# EAGLE design Logger ver2.0.0 (EAGLE 9.6.2)
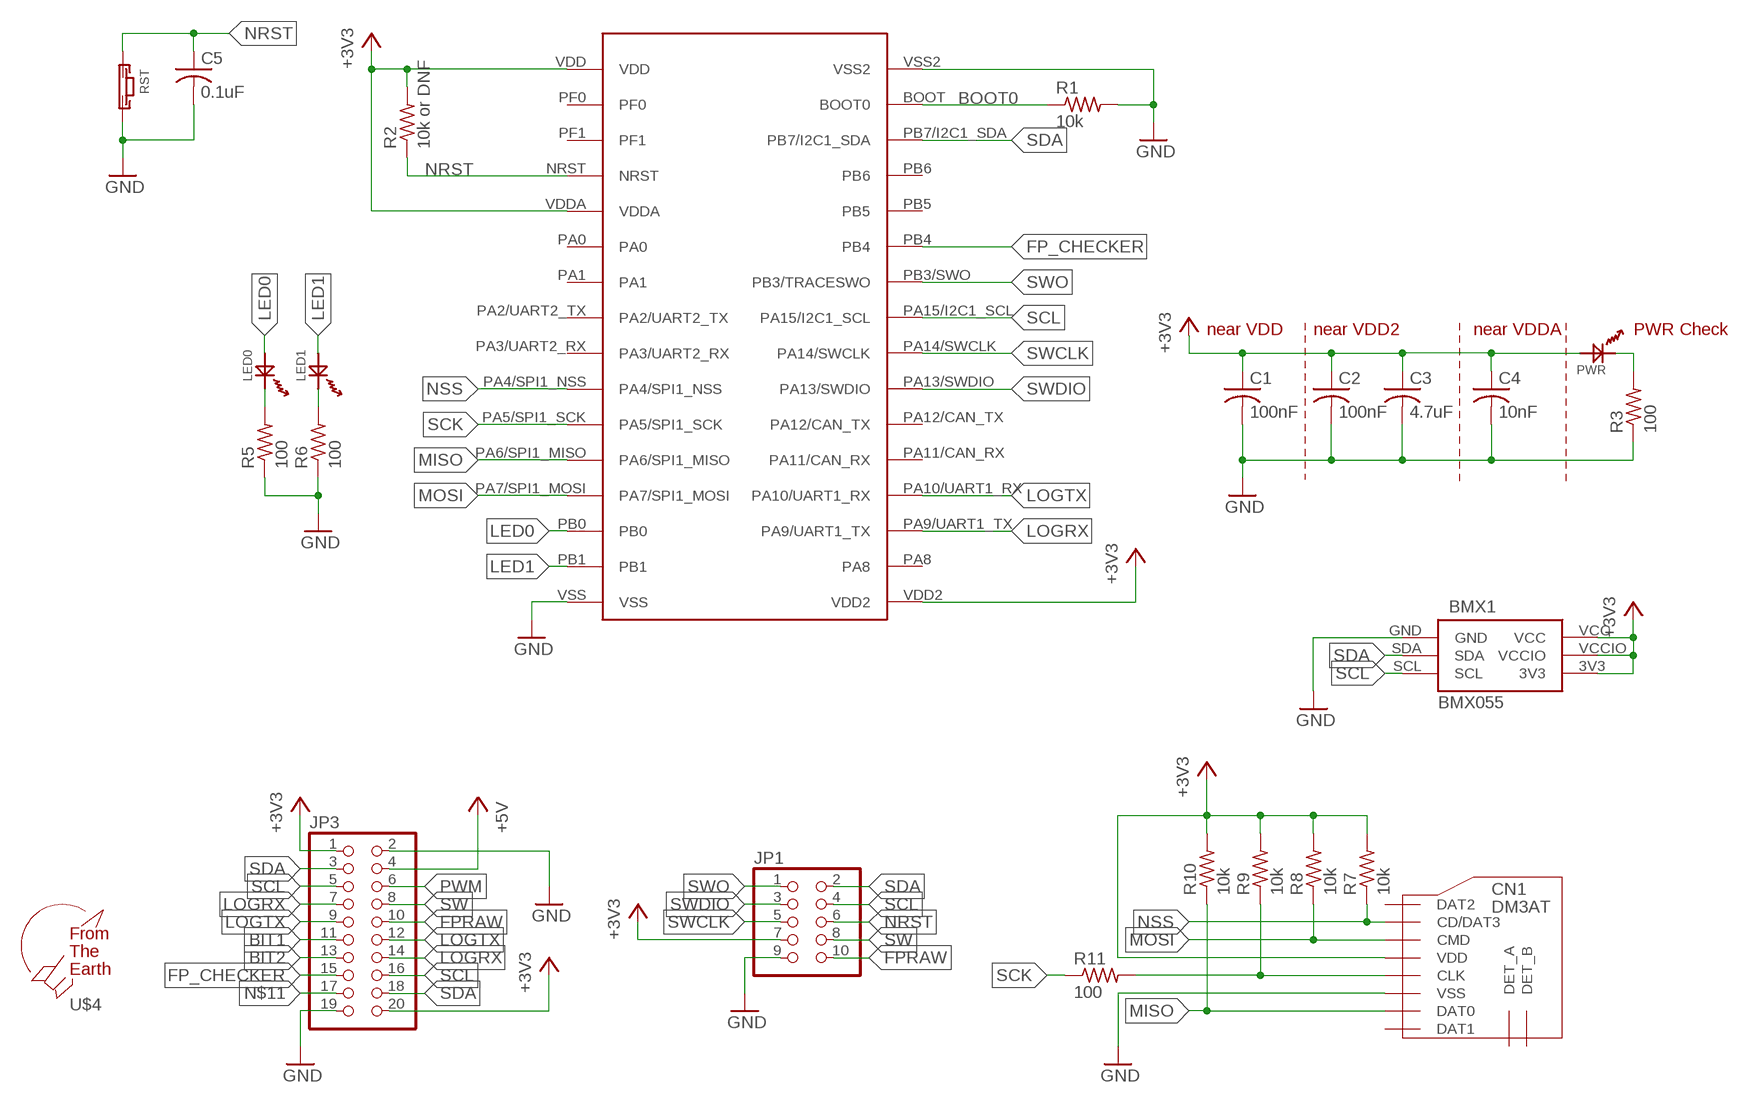
[diagram p0: schematic, sheet 1]

## Parts
BMX1  BMX055  [BMX055]
C1  100nF  C-USC1608  [C1608]
C2  100nF  C-USC1608  [C1608]
C3  4.7uF  C-USC1608  [C1608]
C4  10nF  C-USC1608  [C1608]
C5  0.1uF  C-USC1608  [C1608]
CN1  DM3AT  [DM3AT]
JP1  PINHD-2X5/90  [2X05/90]
JP3  PINHD-2X10/90  [2X10/90]
LED0  OSXX1608C1A  [OSXX1608C1A]
LED1  OSXX1608C1A  [OSXX1608C1A]
PWR  OSXX1608C1A  [OSXX1608C1A]
R1  10k  R-US_R0603  [R0603]
R2  10k or DNF  R-US_R0603  [R0603]
R3  100  R-US_R0603  [R0603]
R5  100  R-US_R0603  [R0603]
R6  100  R-US_R0603  [R0603]
R7  10k  R-US_R0603  [R0603]
R8  10k  R-US_R0603  [R0603]
R9  10k  R-US_R0603  [R0603]
R10  10k  R-US_R0603  [R0603]
R11  100  R-US_R0603  [R0603]
RST  TVAF06-A020B-R  [TVAF06-A020B-R]
U$1  STM32F303K8  [STM32F303K8]
U$4  F.T.E.LOGO  [LOGO]

## Nets
+3V3: BMX1.3V3 BMX1.VCC BMX1.VCCIO C1.1 C2.1 C3.1 C4.1 CN1.VDD JP1.7 JP3.1 JP3.20 PWR.AN R2.2 R7.2 R8.2 R9.2 R10.2 U$1.VDD U$1.VDD2 U$1.VDDA
BIT1: JP3.11
BIT2: JP3.13
BOOT0: R1.1 U$1.BOOT(BOOT0)
FP_CHECKER: JP3.15 U$1.PB4
FPRAW: JP1.10 JP3.10
GND: BMX1.GND C1.2 C2.2 C3.2 C4.2 C5.2 CN1.VSS JP1.9 JP3.2 JP3.19 R1.2 R3.1 R5.1 R6.1 RST.P$2 U$1.VSS U$1.VSS2
LED0: LED0.AN U$1.PB0
LED1: LED1.AN U$1.PB1
LOGRX: JP3.7 JP3.14 U$1.PA9/UART1_TX
LOGTX: JP3.9 JP3.12 U$1.PA10/UART1_RX
MISO: CN1.DAT0 R10.1 U$1.PA6/SPI1_MISO
MOSI: CN1.CMD R8.1 U$1.PA7/SPI1_MOSI
N$1: PWR.CT R3.2
N$2: LED0.CT R5.2
N$4: LED1.CT R6.2
N$7: CN1.CLK R9.1 R11.2
N$11: JP3.4 JP3.17 ; supply symbol labelled +5V
NRST: C5.1 JP1.6 R2.1 RST.P$1 U$1.NRST
NSS: CN1.CD/DAT3 R7.1 U$1.PA4/SPI1_NSS
PWM: JP3.6
SCK: R11.1 U$1.PA5/SPI1_SCK
SCL: BMX1.SCL JP1.4 JP3.5 JP3.16 U$1.PA15/I2C1_SCL
SDA: BMX1.SDA JP1.2 JP3.3 JP3.18 U$1.PB7/I2C1_SDA
SW: JP1.8 JP3.8
SWCLK: JP1.5 U$1.PA14/SWCLK
SWDIO: JP1.3 U$1.PA13/SWDIO
SWO: JP1.1 U$1.PB3/SWO(PB3/TRACESWO)
Unconnected: CN1.DAT1 CN1.DAT2 CN1.DET_A CN1.DET_B U$1.PA0 U$1.PA1 U$1.PA2/UART2_TX U$1.PA3/UART2_RX U$1.PA8 U$1.PA11/CAN_RX U$1.PA12/CAN_TX U$1.PB5 U$1.PB6 U$1.PF0 U$1.PF1

## Notes on the sheet
- near VDD | near VDD2 | near VDDA | PWR Check

## Library data of the parts
BMX1 = BMX055:BMX055
C1-C5 = rcl:C-US: CAPACITOR, American symbol; SPICEPREFIX: C
CN1 = microSD:DM3AT
JP1 = pinhead:PINHD-2X5: PIN HEADER
JP3 = pinhead:PINHD-2X10: PIN HEADER
LED0 LED1 PWR = Chip LED:OSXX1608C1A
R1-R3 R5-R11 = rcl:R-US_: RESISTOR, American symbol; SPICEPREFIX: R
RST = Tact switch:TVAF06-A020B-R
U$1 = STM32F303K8:STM32F303K8
U$4 = logo:F.T.E.LOGO

## Net classes
0 default: width 0.33 mm

## Board
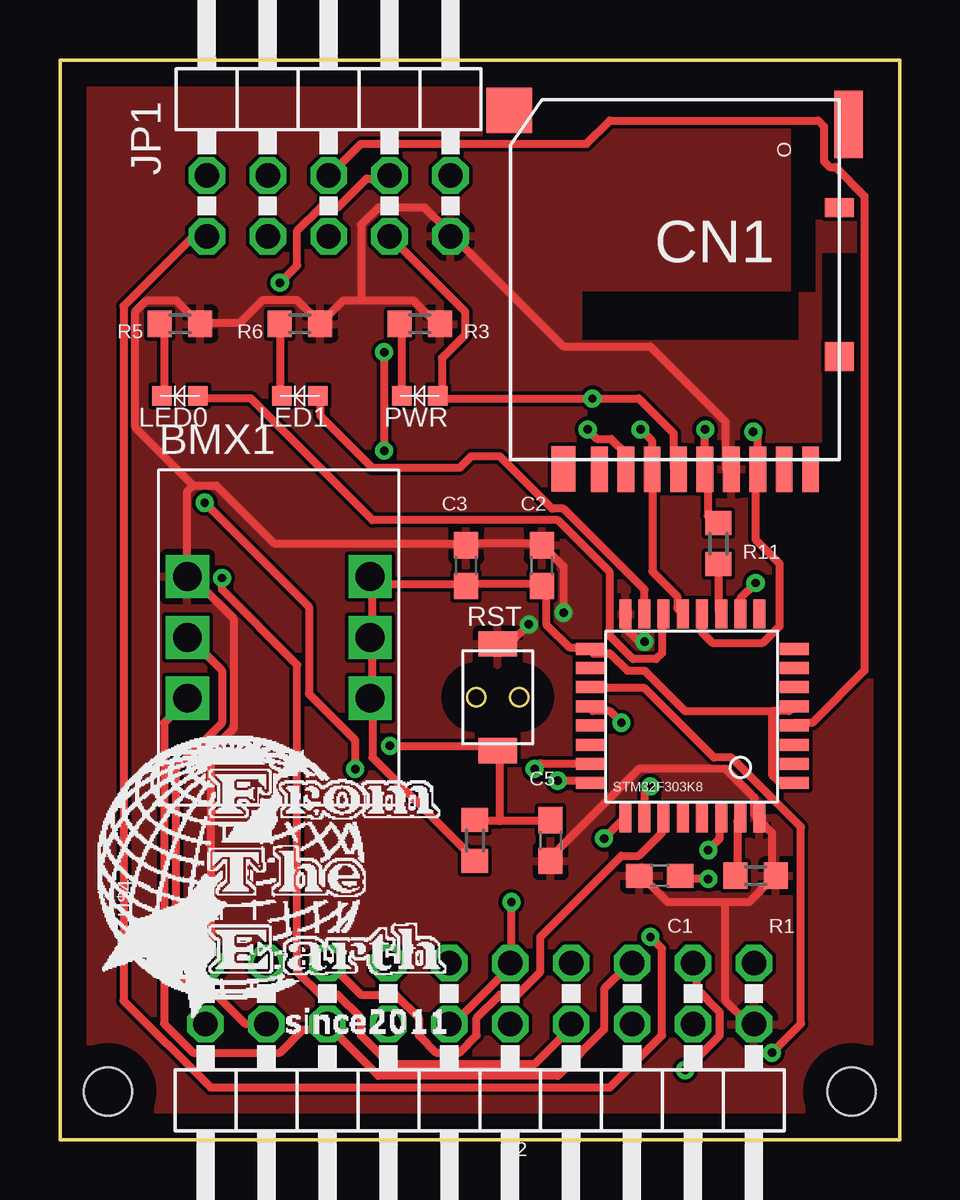
[diagram p1: board, top side]
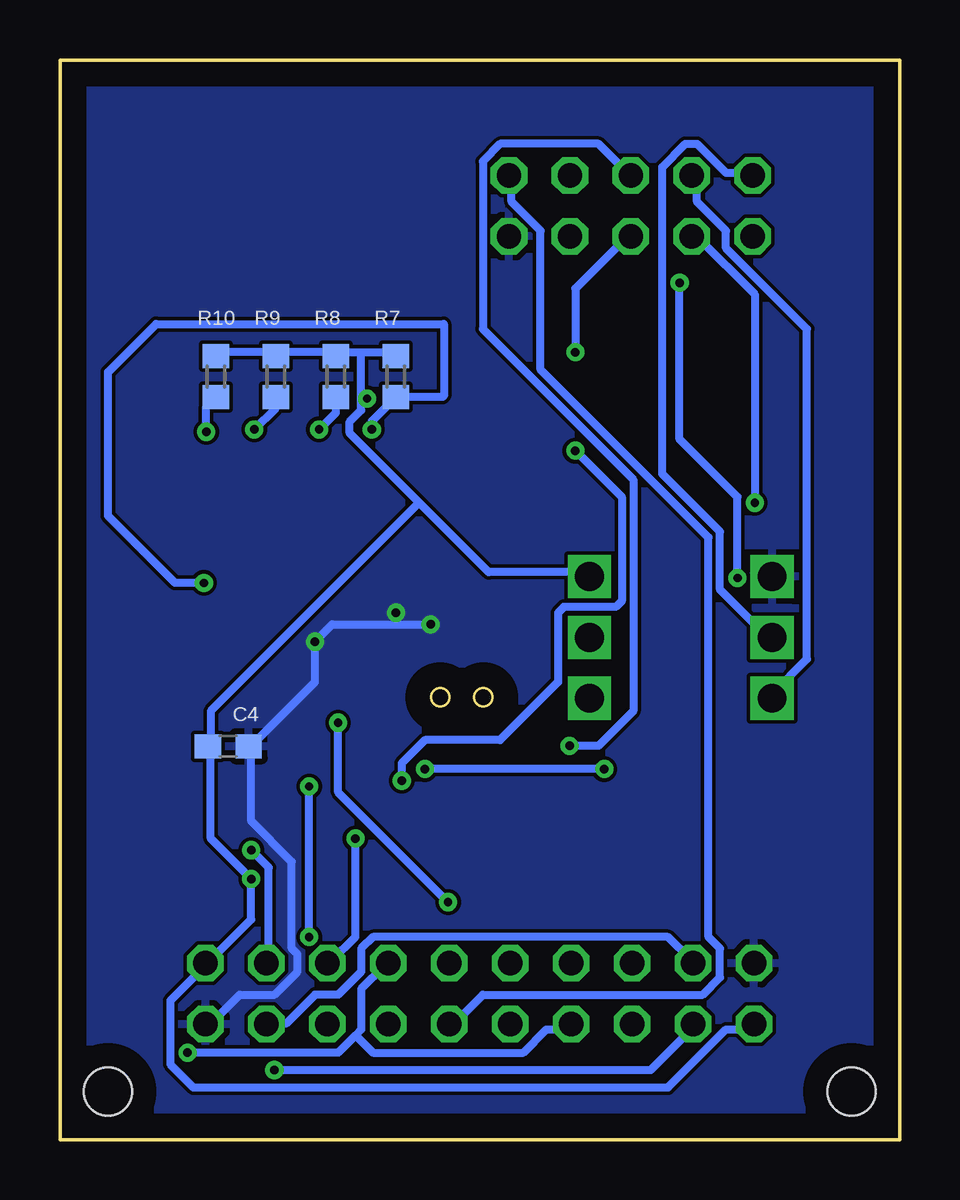
[diagram p2: board, bottom side, seen from below]

Size 35 x 45 mm. Coordinates in mm from the lower left corner, seen from the top.
Outline: 0,0 35,0 35,45 0,45 0,0
Copper layers (1*16): Top 0.035mm / dielectric 1.5mm / Bottom 0.035mm
Design rules "default": minimum track width 6mil, minimum drill 0.35mm, track to track 6mil, track to pad 6mil, pad to pad 6mil, via to via 6mil, smd to smd 6mil, copper to edge 40mil, drill to drill 6mil, minimum pad ring 10mil, minimum via ring 8mil, stop-mask expansion 4mil, vias tented up to drill 0mil, thermal gap 10mil
Holes 2 mm at 2,2 33,2

### Footprints (pad centres in the part's own frame; a part is rotated, then mirrored left to right if it is on the bottom)
BMX055 = drill 1.2 pad 1.5 square: 3V3 8.81,-9.53; GND 1.19,-4.46; SCL 1.19,-9.53; SDA 1.19,-7; VCC 8.81,-4.46; VCCIO 8.81,-7
C1608 = smd 1.1 x 1: 1 -0.85,0; 2 0.85,0
DM3AT = smd 0.7 x 1.9: CD/DAT3 2.2,6.4; CLK -1.1,6.4; CMD 1.1,6.4; DAT0 -3.3,6.4; DAT1 -4.4,6.4; DAT2 3.3,6.4; DET_B -5.5,6.4; VDD 0,6.4; VSS -2.2,6.4 | smd 1.2 x 0.8: DET_A -6.7,-4.5 | smd 1 x 1.9: P$9 4.8,6.381 | smd 1.2 x 1.2: P$11 -6.7,1.7 | smd 1.2 x 2.8: P$13 -7.081,-7.973 | smd 1.9 x 1.9: P$14 7.054,-8.562
2X05/90 = drill 1.016 octagon: 1 -5.08,-6.35; 2 -5.08,-3.81; 3 -2.54,-6.35; 4 -2.54,-3.81; 5 0,-6.35; 6 0,-3.81; 7 2.54,-6.35; 8 2.54,-3.81; 9 5.08,-6.35; 10 5.08,-3.81
2X10/90 = drill 1.016 octagon: 1 -11.43,-6.35; 2 -11.43,-3.81; 3 -8.89,-6.35; 4 -8.89,-3.81; 5 -6.35,-6.35; 6 -6.35,-3.81; 7 -3.81,-6.35; 8 -3.81,-3.81; 9 -1.27,-6.35; 10 -1.27,-3.81; 11 1.27,-6.35; 12 1.27,-3.81; 13 3.81,-6.35; 14 3.81,-3.81; 15 6.35,-6.35; 16 6.35,-3.81; 17 8.89,-6.35; 18 8.89,-3.81; 19 11.43,-6.35; 20 11.43,-3.81
OSXX1608C1A = smd 0.8 x 0.8: AN -0.75,0; CT 0.75,0
R0603 = smd 1 x 1.1: 1 -0.85,0; 2 0.85,0
TVAF06-A020B-R = smd 1.6 x 1.05: P$1 0,2.225; P$2 0,-2.225
STM32F303K8 = smd 0.5 x 1.2: BOOT 1.6,8.5; PA3/UART2_RX 0.8,0; PA4/SPI1_NSS 1.6,0; PA5/SPI1_SCK 2.4,0; PA6/SPI1_MISO 3.2,0; PA7/SPI1_MOSI 4,0; PA15/I2C1_SCL 6.4,8.5; PB0 4.8,0; PB1 5.6,0; PB3/SWO 5.6,8.5; PB4 4.8,8.5; PB5 4,8.5; PB6 3.2,8.5; PB7/I2C1_SDA 2.4,8.5; VSS 0.8,8.5; VSS2 6.4,0 | smd 1.2 x 0.5: NRST -0.65,4.65; PA0 -0.65,3.05; PA1 -0.65,2.25; PA2/UART2_TX -0.65,1.45; PA8 7.85,2.25; PA9/UART1_TX 7.85,3.05; PA10/UART1_RX 7.85,3.85; PA11/CAN_RX 7.85,4.65; PA12/CAN_TX 7.85,5.45; PA13/SWDIO 7.85,6.25; PA14/SWCLK 7.85,7.05; PF0 -0.65,6.25; PF1 -0.65,5.45; VDD -0.65,7.05; VDD2 7.85,1.45; VDDA -0.65,3.85

### Placement (x,y rotation side)
BMX1  4.12,27.92 0 top
C1  25,11 180 top
C2  20.09,23.92 90 top
C3  16.93,23.92 90 top
C4  27.99,16.39 0 bottom
C5  20.45,12.46 270 top
CN1  25.79,34.34 180 top
JP1  11.2,44 0 top
JP3  17.5,1 180 top
LED0  5,31 180 top
LED1  10,31 180 top
PWR  15,31 180 top
R1  29,11 0 top
R2  17.3,12.46 270 top
R3  15,34 180 top
R5  5,34 180 top
R6  10,34 180 top
R7  21,31.8 90 bottom
R8  23.5,31.8 90 bottom
R9  26,31.8 90 bottom
R10  28.5,31.8 90 bottom
R11  27.45,24.84 90 top
RST  18.25,18.43 180 top
U$1  29.96,21.91 180 top
U$4  1,3 0 top

### Tracks (layer width: path | path; a pad name or v marks a point on that pad's centre or on a via)
+3V3  (via drill 0.35)
  Top 0.33: v27.03,10.86 26.06,10.86 C1.1 | JP1.7 13.75,37.64 16.89,34.51 16.89,33.54 15.93,32.58 15.93,31.13 PWR.AN 15.93,30.89 v22.2,30.89 24.13,30.89 25.58,29.44 25.58,27.99 CN1.VDD | 29.68,17.86 29.68,15.2 29.92,14.96 30.4,14.96 U$1.VDD | 29.68,17.86 30.4,17.86 U$1.VDDA | 29.68,17.86 26.06,17.86 24.37,19.55 23.65,19.55 22.92,20.27 22.2,20.27 U$1.VDD2 21.96,20.51 21.23,20.51 20.27,21.48 20.27,22.92 C2.1 20.03,23.16 17.13,23.16 C3.1 16.89,23.16 13.03,23.16 | R2.2 17.13,11.82 13.03,15.93 13.03,18.34 BMX1.3V3 13.03,18.58 13.03,20.75 BMX1.VCCIO 13.03,20.99 13.03,23.16 | 13.03,23.16 13.03,23.41 BMX1.VCC 13.03,23.16
  Bottom 0.33: JP3.20 6.27,4.58 7.24,4.58 9.65,2.17 29.44,2.17 30.4,3.14 30.4,5.79 28.96,7.24 JP3.1 28.71,7.48 27.03,9.17 v27.03,10.86 28.71,12.55 28.71,16.17 C4.1 28.71,16.41 28.71,17.86 20.03,26.54 | 22.44,32.82 23.41,32.82 R8.2 23.65,32.82 25.82,32.82 R9.2 26.06,32.82 28.47,32.82 R10.2 | 22.44,32.82 21.23,32.82 R7.2 | 22.44,30.89 22.44,30.4 22.92,29.92 22.92,29.44 20.03,26.54 | 22.44,30.89 22.44,32.82 | 20.03,26.54 17.13,23.65 13.03,23.65 BMX1.VCC | 22.44,30.89 v22.2,30.89
BOOT0
  Top 0.33: R1.1 28.23,11.1 28.23,13.27 U$1.BOOT
FP_CHECKER
  Top 0.33: U$1.PB4 25.09,13.27 25.09,12.79 24.13,11.82 23.41,11.82 20.03,8.45 20.03,7 19.06,6.03 18.34,6.03 17.37,5.07 17.37,4.34 16.65,3.62 15.68,3.62 14.96,4.34 14.96,5.07 13.99,6.03 12.55,6.03 11.34,7.24 JP3.15
FPRAW
  Bottom 0.33: JP1.10 16.17,40.06 16.17,39.09 14.96,37.88 14.96,32.09 7.96,25.09 7.96,8.45 7.48,7.96 7.48,6.76 8.2,6.03 17.37,6.03 18.58,4.83 JP3.10
GND  (via drill 0.35)
  Top 0.33: 10.86,34.02 9.89,34.99 8.45,34.99 7.48,34.02 6.03,34.02 R5.1 5.79,34.02 4.83,34.99 3.62,34.99 3.14,34.51 3.14,29.68 5.55,27.27 | 12.55,34.99 11.82,34.99 10.86,34.02 | 12.55,34.99 14.72,34.99 15.68,34.02 R3.1 | 10.86,34.02 R6.1 | CN1.VSS 27.75,27.99 27.75,29.92 24.61,33.06 20.99,33.06 16.41,37.64 JP1.9 16.17,37.88 15.2,38.85 13.27,38.85 12.55,38.12 12.55,34.99 | 27.75,9.89 28.71,9.89 29.68,10.86 R1.2 29.68,11.1 29.68,12.79 29.2,13.27 U$1.VSS 28.96,13.51 28.96,14.24 27.75,15.44 24.13,15.44 20.51,11.82 C5.2 | 27.75,9.89 25.34,9.89 24.37,10.86 C1.2 | v24.37,20.75 24.13,20.75 23.65,21.23 23.65,21.72 U$1.VSS2 | v19.55,21.48 18.82,20.75 18.34,20.75 RST.P$2 | 27.75,9.89 27.75,5.79 28.71,4.83 JP3.2 | 5.55,27.27 6.51,27.27 8.93,24.85 16.89,24.85 C3.2 17.13,24.85 20.03,24.85 C2.2 20.27,24.61 20.99,23.89 v20.99,21.96 | 5.55,27.27 5.31,27.03 5.31,23.65 BMX1.GND 5.55,23.41 7.24,21.72 7.24,17.13 6.27,16.17 6.27,7.48 JP3.19
  Bottom 0.33: JP3.2 28.71,4.83 27.51,6.03 26.06,6.03 25.09,7 25.09,7.72 25.34,7.96 25.34,11.58 27.03,13.27 27.03,16.17 C4.2 27.03,16.41 24.37,19.06 v24.37,20.75 23.65,21.48 20.99,21.48 | 20.99,21.48 v19.55,21.48 | v20.99,21.96 20.99,21.48
  pour Bottom: -3,47 37,47 37,-2 -3,-2
  pour Top: -5,48 38,48 38,-3 -5,-3
LED0
  Top 0.33: LED0.AN 5.79,30.89 7.96,30.89 13.03,25.82 20.75,25.82 22.92,23.65 22.92,20.99 23.89,20.03 24.85,20.03 25.09,20.27 25.09,21.72 U$1.PB0
LED1
  Top 0.33: LED1.AN 10.86,30.89 10.86,30.16 13.03,27.99 16.65,27.99 17.13,28.47 18.34,28.47 20.51,26.3 20.99,26.3 24.37,22.92 24.37,21.96 U$1.PB1
LOGRX  (via drill 0.35)
  Top 0.33: v29.68,3.62 30.89,4.83 30.89,13.03 27.99,15.93 27.27,15.93 24.37,18.82 22.2,18.82 U$1.PA9/UART1_TX
  Bottom 0.33: v29.68,3.62 23.41,3.62 22.68,4.34 | 22.68,4.34 22.44,4.58 22.44,6.27 21.48,7.24 JP3.7 | 22.68,4.34 21.96,3.62 15.68,3.62 14.72,4.58 13.75,4.58 JP3.14
LOGTX  (via drill 0.35)
  Top 0.33: v23.41,17.37 22.92,17.86 22.2,17.86 U$1.PA10/UART1_RX | v18.82,9.89 18.82,7.48 JP3.9 18.82,7.24 16.41,4.83 JP3.12
  Bottom 0.33: v23.41,17.37 23.41,14.48 v18.82,9.89
MISO  (via drill 0.35)
  Top 0.33: U$1.PA6/SPI1_MISO 26.77,21.14 27.2,20.7 29.3,20.7 30,21.4 30,24 29,25 29,27.85 CN1.DAT0 29.09,29.31 v28.9,29.5
  Bottom 0.33: v28.9,29.5 28.9,30.55 R10.1
MOSI  (via drill 0.35)
  Top 0.33: U$1.PA7/SPI1_MOSI 25.73,22.14 25.73,22.64 24.69,23.68 CN1.CMD 24.69,29.11 v24.2,29.6
  Bottom 0.33: v24.2,29.6 23.5,30.3 R8.1
N$1
  Top 0.33: PWR.CT 14.24,31.13 14.24,33.78 R3.2
N$2
  Top 0.33: LED0.CT 4.34,31.13 4.34,33.78 R5.2
N$4
  Top 0.33: LED1.CT 9.17,31.13 9.17,33.78 R6.2
N$7  (via drill 0.35)
  Top 0.33: R11.2 27.31,25.69 27,26 27,27.83 CN1.CLK v26.89,29.59 v26.9,29.6
  Bottom 0.33: v26.9,29.6 26,30.5 R9.1
N$11
  Bottom 0.33: JP3.4 26.3,4.83 25.58,4.83 24.37,6.03 23.41,6.03 22.44,7 22.44,7.96 21.96,8.45 9.65,8.45 8.69,7.48 JP3.17
NRST  (via drill 0.35)
  Top 0.33: 18.34,13.27 20.27,13.27 C5.1 | 18.34,13.27 17.37,13.27 R2.1 | 18.34,13.27 18.34,16.17 RST.P$1 18.1,16.41 v13.75,16.41 | U$1.NRST 30.64,17.37 31.37,17.37 33.54,19.55 33.54,39.33 32.33,40.54 32.09,40.54 31.85,40.78 31.85,42.23 31.61,42.47 22.92,42.47 21.96,41.5 12.55,41.5 11.34,40.3 JP1.6
  Bottom 0.33: v13.75,16.41 12.55,16.41 11.1,17.86 11.1,27.51 17.37,33.78 17.37,40.78 16.65,41.5 12.55,41.5 11.34,40.3 JP1.6
NSS  (via drill 0.35)
  Top 0.33: U$1.PA4/SPI1_NSS 28.36,22.57 v29,23.2 | v22,29.6 22.39,29.21 22.97,29.21 23.59,28.59 CN1.CD/DAT3
  Bottom 0.33: v29,23.2 30.2,23.2 33,26 33,32 31,34 19,34 19,31 19.05,30.95 R7.1 22,29.95 v22,29.6
SCK
  Top 0.33: R11.1 27.45,22.02 U$1.PA5/SPI1_SCK
SCL  (via drill 0.35)
  Top 0.33: v22.68,12.55 23.41,13.27 U$1.PA15/I2C1_SCL | JP3.5 23.65,7.24 22.68,6.27 22.68,4.58 20.75,2.65 13.27,2.65 11.34,4.58 JP3.16 11.1,4.58 10.13,4.58 9.17,3.62 5.55,3.62 4.34,4.83 4.34,17.37 5.31,18.34 BMX1.SCL
  Bottom 0.33: v22.68,12.55 22.68,8.45 23.65,7.48 JP3.5 | JP1.4 8.45,40.06 8.45,39.09 7.24,37.88 7.24,37.16 3.86,33.78 3.86,20.03 5.31,18.58 BMX1.SCL
SDA  (via drill 0.35)
  Top 0.33: v27.03,12.06 27.51,12.55 27.51,13.27 U$1.PB7/I2C1_SDA | JP3.18 8.45,4.83 7.72,4.83 6.51,6.03 5.79,6.03 4.83,7 4.83,15.44 6.76,17.37 6.76,19.55 5.55,20.75 BMX1.SDA | v26.06,2.9 27.51,4.34 27.51,5.31 26.54,6.27 26.54,7.24 JP3.3
  Bottom 0.33: v27.03,12.06 26.3,11.34 26.3,7.48 JP3.3 | JP1.2 6.27,40.3 7.24,40.3 8.45,41.5 8.93,41.5 9.89,40.54 9.89,27.75 7.48,25.34 7.48,22.92 5.55,20.99 BMX1.SDA | v26.06,2.9 10.38,2.9 8.69,4.58 JP3.18
SW  (via drill 0.35)
  Top 0.33: v9.17,35.71 9.89,36.44 9.89,37.88 10.86,38.85 11.58,38.85 12.79,40.06 13.51,40.06 JP1.8 | v6.76,23.41 6.76,22.92 9.89,19.79 9.89,7 10.86,6.03 11.58,6.03 12.55,5.07 12.55,4.34 13.75,3.14 19.79,3.14 21.23,4.58 JP3.8
  Bottom 0.33: v9.17,35.71 9.17,29.2 6.76,26.78 v6.76,23.41
SWCLK  (via drill 0.35)
  Top 0.33: v20.75,14.96 21.96,14.96 U$1.PA14/SWCLK | v13.51,32.82 v13.51,28.71
  Bottom 0.33: v20.75,14.96 20.75,15.68 19.79,16.65 16.65,16.65 14.24,19.06 14.24,21.96 13.99,22.2 11.82,22.2 11.58,22.44 11.58,26.78 v13.51,28.71 | v13.51,32.82 13.51,35.47 11.34,37.64 JP1.5
SWDIO  (via drill 0.35)
  Top 0.33: v19.79,15.44 20.03,15.68 21.96,15.68 U$1.PA13/SWDIO | v12.31,15.44 12.31,16.65 10.38,18.58 10.38,22.2 v6.03,26.54
  Bottom 0.33: v12.31,15.44 v19.79,15.44 | v6.03,26.54 6.03,35.23 8.45,37.64 JP1.3
SWO  (via drill 0.35)
  Top 0.33: v24.61,14.72 24.37,14.48 24.37,13.51 U$1.PB3/SWO | v24.61,8.45 25.09,7.96 25.09,4.34 22.92,2.17 6.27,2.17 2.65,5.79 2.65,34.75 5.55,37.64 6.03,37.64 JP1.1
  Bottom 0.33: v24.61,8.45 v24.61,14.72

### Text on the board
tNames: O